# Altium project OSSI-1 Z Panel.PrjPcb
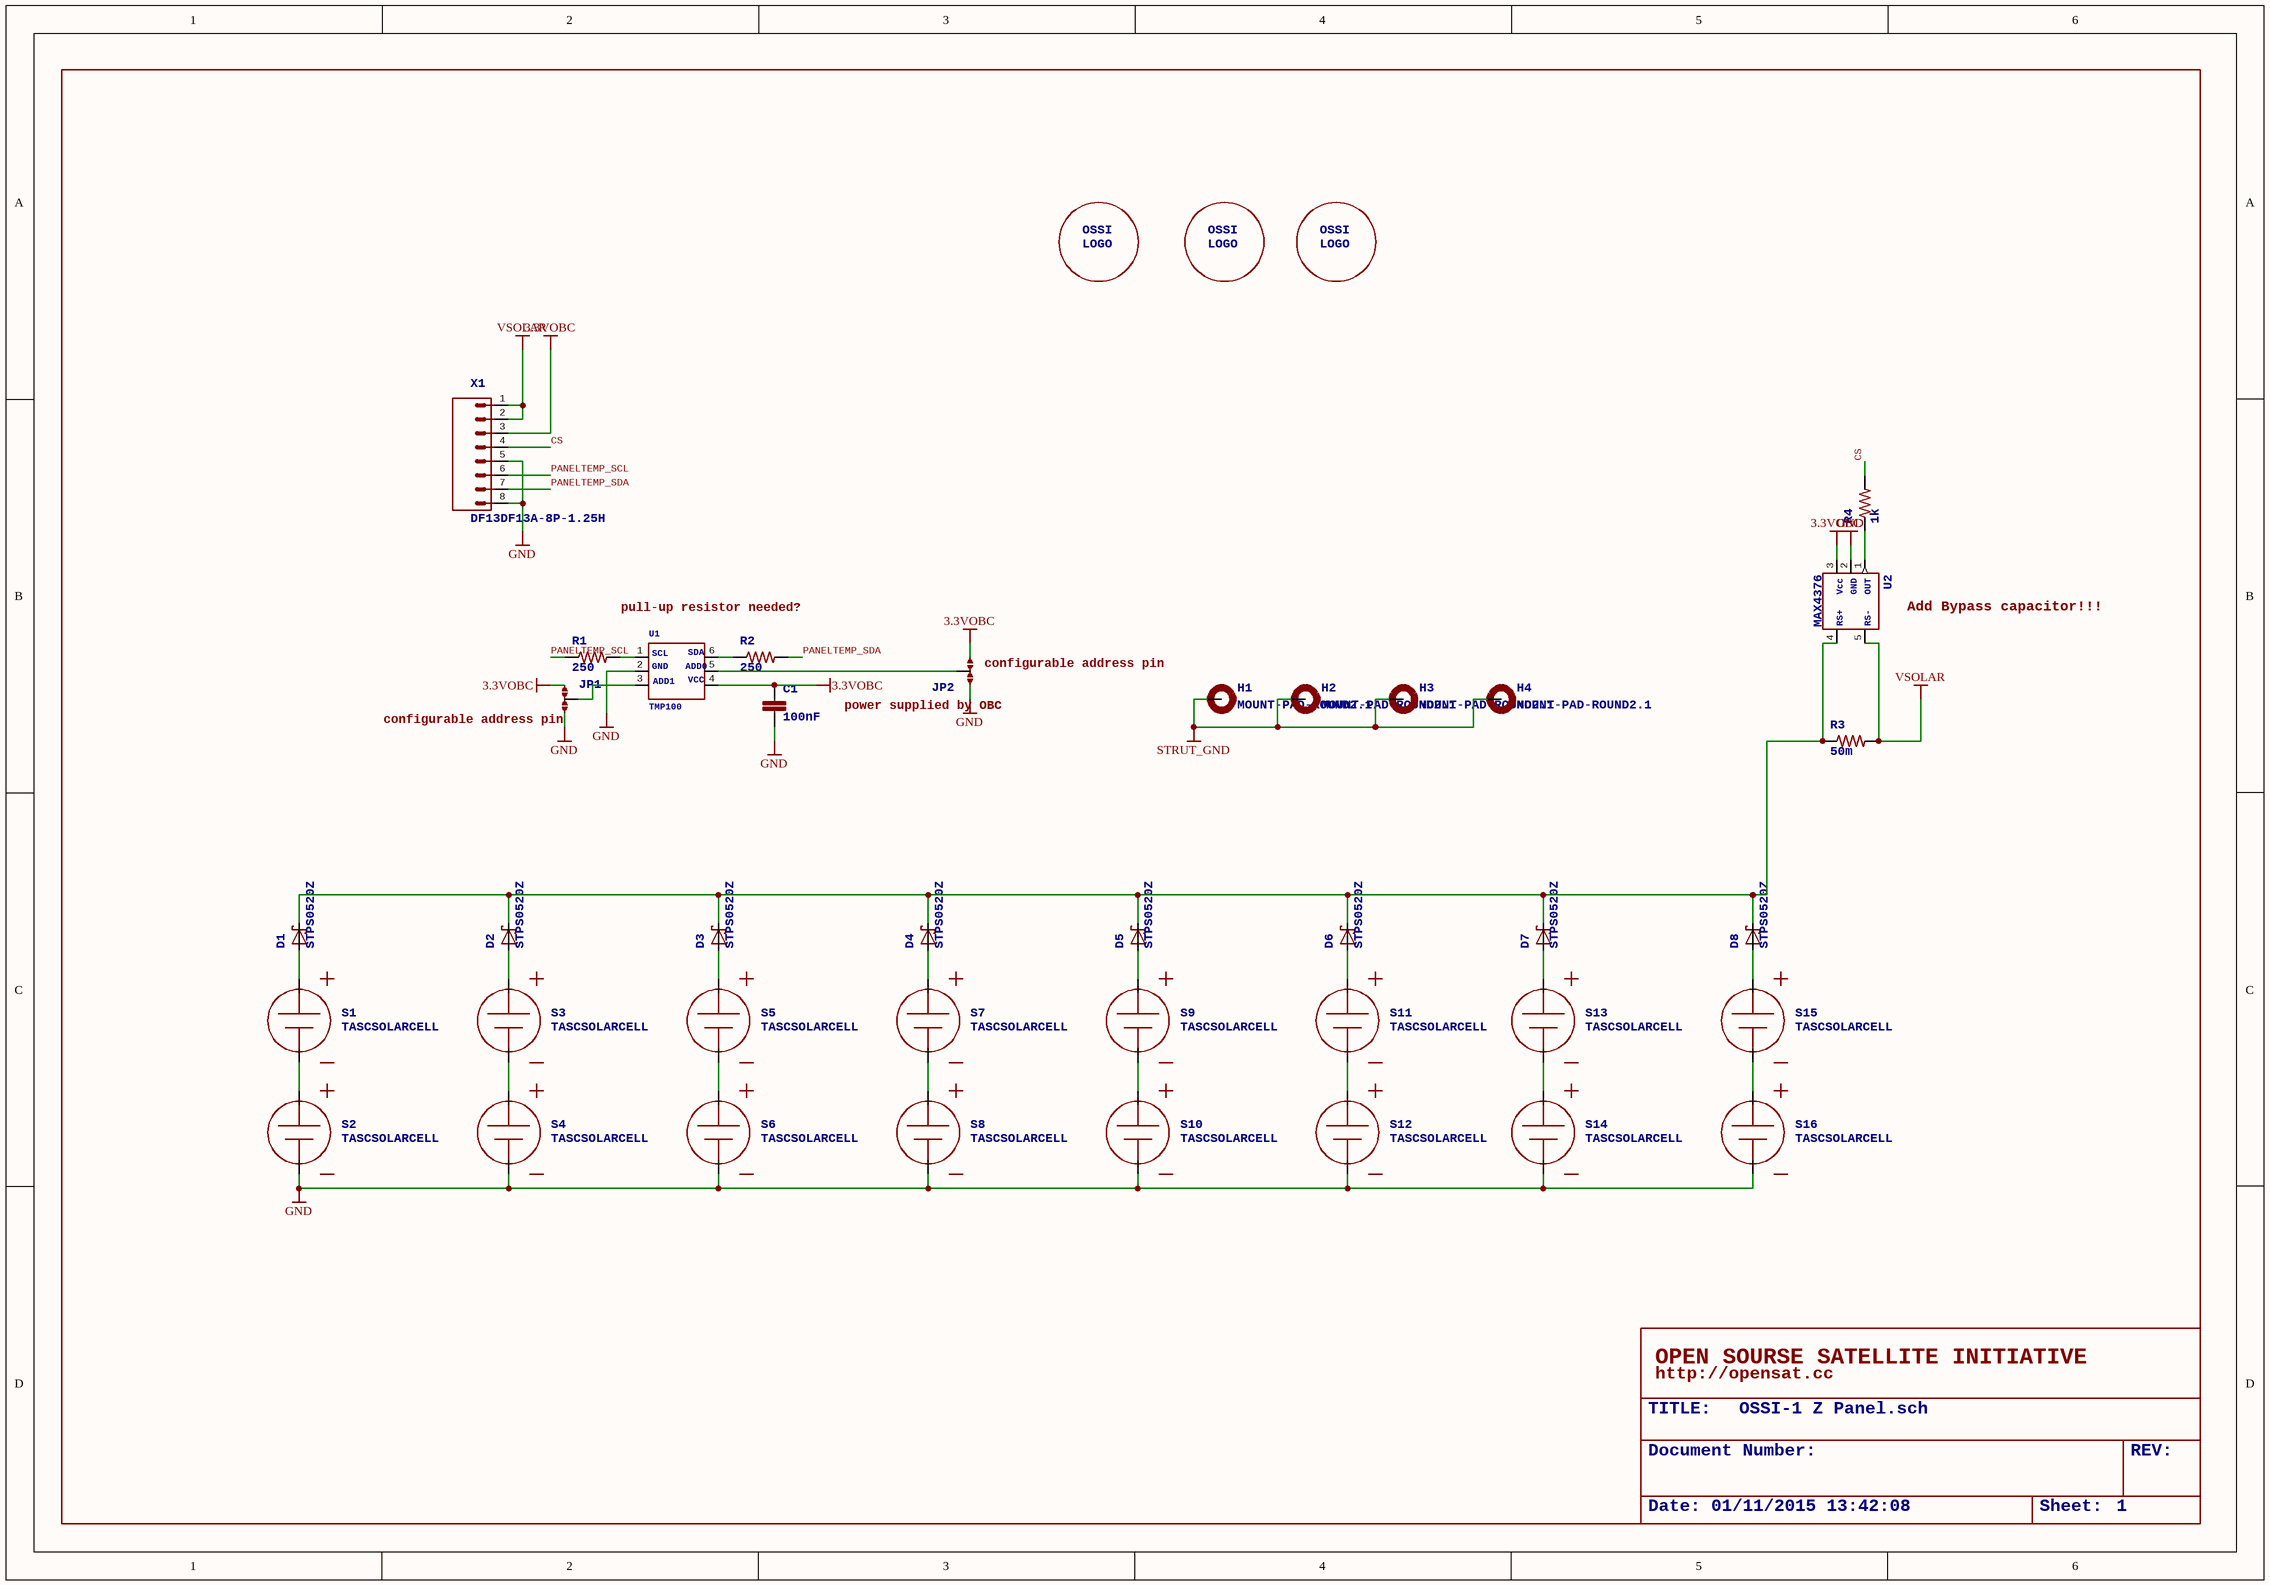
[diagram p0: OSSI-1 Z Panel.SchDoc]
1 sheet, 41 parts. Net scope: global (net labels, ports and power ports of the same name join across sheets).
Board file: OSSI-1 Z Panel.PcbDoc

## Sheet OSSI-1 Z Panel.SchDoc: TITLE:
size 410 x 286 mm; Date: Date:; >LAST_DATE_TIME: 01/11/2015 13:42:08; Sheet:: Sheet:; >SHEET: 1; REV:: REV:; Document Number:: Document Number:; >DRAWING_NAME: OSSI-1 Z Panel.sch

### Parts
C1  >NAME: C1  [C0603(1608)]  (hidden comment: 100nF)
D1  >NAME: D1  [SOD-123]  (hidden comment: STPS0520Z)
D2  >NAME: D2  [SOD-123]  (hidden comment: STPS0520Z)
D3  >NAME: D3  [SOD-123]  (hidden comment: STPS0520Z)
D4  >NAME: D4  [SOD-123]  (hidden comment: STPS0520Z)
D5  >NAME: D5  [SOD-123]  (hidden comment: STPS0520Z)
D6  >NAME: D6  [SOD-123]  (hidden comment: STPS0520Z)
D7  >NAME: D7  [SOD-123]  (hidden comment: STPS0520Z)
D8  >NAME: D8  [SOD-123]  (hidden comment: STPS0520Z)
H1  >NAME: H1  [2.1-PAD-ROUND]  (hidden comment: MOUNT-PAD-ROUND2.1)
H2  >NAME: H2  [2.1-PAD-ROUND]  (hidden comment: MOUNT-PAD-ROUND2.1)
H3  >NAME: H3  [2.1-PAD-ROUND]  (hidden comment: MOUNT-PAD-ROUND2.1)
H4  >NAME: H4  [2.1-PAD-ROUND]  (hidden comment: MOUNT-PAD-ROUND2.1)
JP1  >NAME: JP1  [JP2SMD0603]  (hidden comment: JP2)
JP2  JP2  [JP2SMD0603]
R1  >NAME: R1  [R0603(1608)]  (hidden comment: 250)
R2  >NAME: R2  [R0603(1608)]  (hidden comment: 250)
R3  >NAME: R3  [WSL1206]  (hidden comment: 50m)
R4  >NAME: R4  [R0603(1608)]  (hidden comment: 1k)
S1  >NAME: S1  [TASCSOLARCELL]  (hidden comment: TASCSOLARCELL)
S2  >NAME: S2  [TASCSOLARCELL]  (hidden comment: TASCSOLARCELL)
S3  >NAME: S3  [TASCSOLARCELL]  (hidden comment: TASCSOLARCELL)
S4  >NAME: S4  [TASCSOLARCELL]  (hidden comment: TASCSOLARCELL)
S5  >NAME: S5  [TASCSOLARCELL]  (hidden comment: TASCSOLARCELL)
S6  >NAME: S6  [TASCSOLARCELL]  (hidden comment: TASCSOLARCELL)
S7  >NAME: S7  [TASCSOLARCELL]  (hidden comment: TASCSOLARCELL)
S8  >NAME: S8  [TASCSOLARCELL]  (hidden comment: TASCSOLARCELL)
S9  >NAME: S9  [TASCSOLARCELL]  (hidden comment: TASCSOLARCELL)
S10  >NAME: S10  [TASCSOLARCELL]  (hidden comment: TASCSOLARCELL)
S11  >NAME: S11  [TASCSOLARCELL]  (hidden comment: TASCSOLARCELL)
S12  >NAME: S12  [TASCSOLARCELL]  (hidden comment: TASCSOLARCELL)
S13  >NAME: S13  [TASCSOLARCELL]  (hidden comment: TASCSOLARCELL)
S14  >NAME: S14  [TASCSOLARCELL]  (hidden comment: TASCSOLARCELL)
S15  >NAME: S15  [TASCSOLARCELL]  (hidden comment: TASCSOLARCELL)
S16  >NAME: S16  [TASCSOLARCELL]  (hidden comment: TASCSOLARCELL)
U1  >NAME: U1  [SOT23-6DBV]  (hidden comment: TMP100)
U2  >NAME: U2  [SOT23-5DBV]  (hidden comment: MAX4376)
U$1  OSSILOGO-10  [OSSILOGO1010]  (value not drawn)
U$2  OSSILOGO-10  [OSSILOGO1010]  (value not drawn)
U$3  OSSITAGCC  [CCLOGO]  (value not drawn)
X1  >NAME: X1  [DF13A-8P]  (hidden comment: DF13DF13A-8P-1.25H)

### Nets
3.3VOBC: C1.1 JP1.1 JP2.3 U1.4 U2.3(P$3) X1.3
GND: C1.2 JP1.3 JP2.1 S2.N S4.N S6.N S8.N S10.N S12.N S14.N S16.N U1.2 U2.2(P$2) X1.5 X1.8
STRUT_GND: H1.B3,2(MOUNT) H2.B3,2(MOUNT) H3.B3,2(MOUNT) H4.B3,2(MOUNT)
VSOLAR: R3.P$2 U2.5(P$5) X1.1 X1.2
CS: R4.2 X1.4
PANELTEMP_SCL: R1.1 X1.6
PANELTEMP_SDA: R2.2 X1.7
NetD1_A: D1.A S1.P
NetD1_C: D1.C D2.C D3.C D4.C D5.C D6.C D7.C D8.C R3.P$1 U2.4(P$4)
NetD2_A: D2.A S3.P
NetD3_A: D3.A S5.P
NetD4_A: D4.A S7.P
NetD5_A: D5.A S9.P
NetD6_A: D6.A S11.P
NetD7_A: D7.A S13.P
NetD8_A: D8.A S15.P
NetJP1_2: JP1.2 U1.3
NetJP2_2: JP2.2 U1.5
NetR1_2: R1.2 U1.1
NetR2_1: R2.1 U1.6
NetR4_1: R4.1 U2.1(P$1)
NetS1_N: S1.N S2.P
NetS3_N: S3.N S4.P
NetS5_N: S5.N S6.P
NetS7_N: S7.N S8.P
NetS9_N: S9.N S10.P
NetS11_N: S11.N S12.P
NetS13_N: S13.N S14.P
NetS15_N: S15.N S16.P

### Notes on the sheet
- pull-up resistor needed?
- (near U2) Add Bypass capacitor!!!
- (near JP2) configurable address pin
- (near JP1) configurable address pin
- (near JP2) power supplied by OBC
- OPEN SOURSE SATELLITE INITIATIVE
- http://opensat.cc

### Library data of the parts
C1 = C0603(1608): >VALUE: 100nF
D1-D8 = STPS0520Z: We use STPS0520Z by st.com diode for solar cell schottky diode.<br/> / If = 500mA <br /> / Vrrm = 20V<br /> / Vf max = 0.32V<br />; >VALUE: STPS0520Z
R1 R2 R4 = R0603(1608)
  R1 R2: >VALUE: 250
  R4: >VALUE: 1k
R3 = RWSL1206: >VALUE: 50m
U1 = TMP100: TMP100 Digital Temerature Sensor with I2C Interface from Texas Instruments; >VALUE: TMP100; VCC: VCC; SCL: SCL; SDA: SDA; GND: GND; ADD0: ADD0; ADD1: ADD1
X1 = DF13DF13A-8P-1.25H: Hirose DF13 series connector; >VALUE: DF13DF13A-8P-1.25H
H1-H4 = MOUNT-PAD-ROUND2.1: >VALUE: MOUNT-PAD-ROUND2.1
JP1 JP2 = JP2
  JP2: >NAME: JP2
S1-S16 = TASCSOLARCELL: >VALUE: TASCSOLARCELL
U2 = MAX4376: >VALUE: MAX4376; OUT: OUT; GND: GND; Vcc: Vcc; RS+: RS+; RS-: RS-
U$1 U$2 = OSSILOGO-10: OSSI: OSSI; LOGO: LOGO
U$3 = OSSITAGCC: OSSI: OSSI; LOGO: LOGO